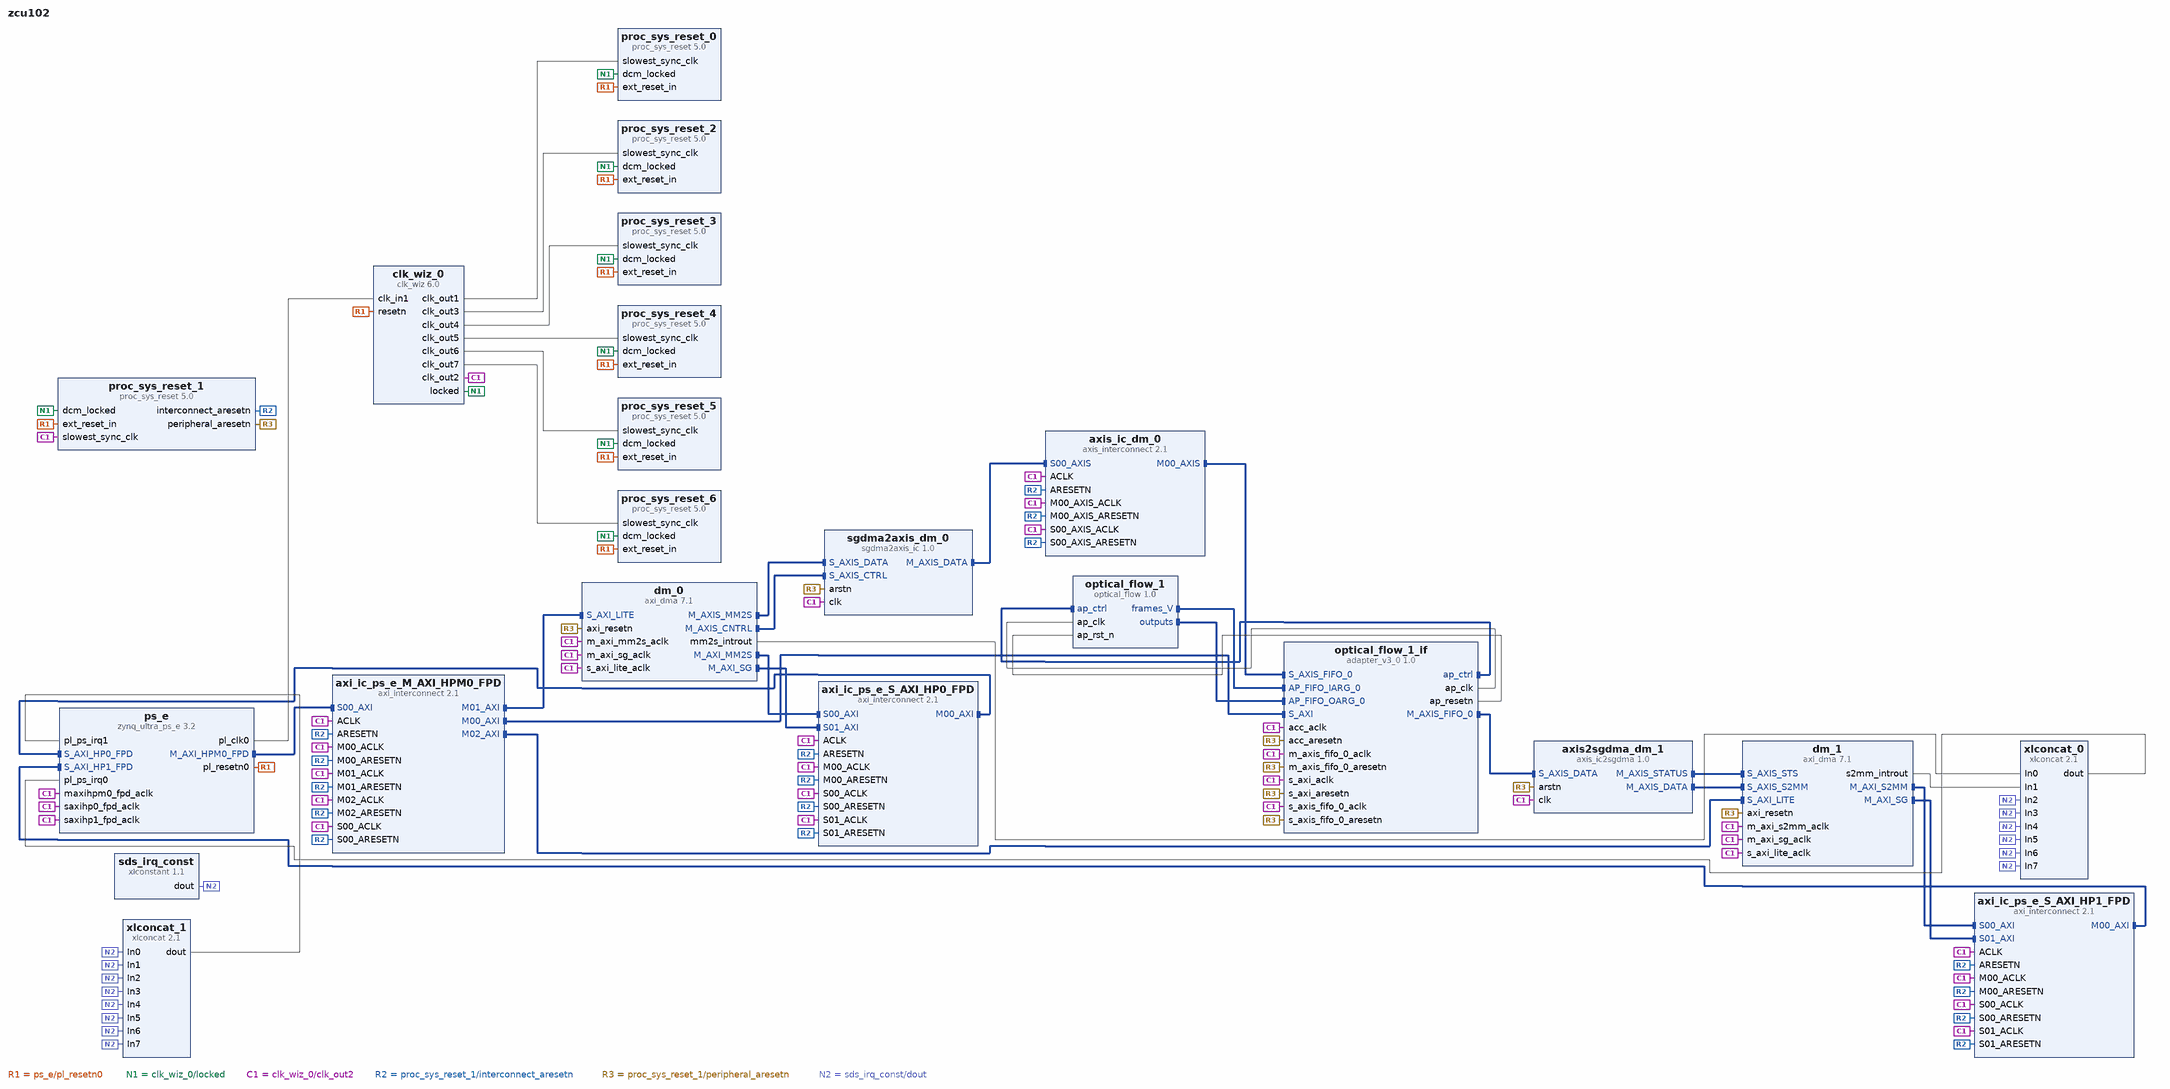
[diagram p0: block diagram of the top level]
# Vivado block design zcu102, xczu9eg-ffvb1156-2-e, Vivado 2018.2
create_bd_design zcu102

create_bd_cell -type ip -vlnv xilinx.com:ip:zynq_ultra_ps_e:3.2 ps_e
set_property -dict [list \
  CONFIG.PSU__PSS_REF_CLK__FREQMHZ 33.330 \
  CONFIG.PSU__CAN1__PERIPHERAL__ENABLE 1 \
  CONFIG.PSU__CAN1__PERIPHERAL__IO {MIO 24 .. 25} \
  CONFIG.PSU__DPAUX__PERIPHERAL__ENABLE 1 \
  CONFIG.PSU__DPAUX__PERIPHERAL__IO {MIO 27 .. 30} \
  CONFIG.PSU__GEM__TSU__ENABLE 0 \
  CONFIG.PSU__FPGA_PL0_ENABLE 1 \
  CONFIG.PSU__ENET3__PERIPHERAL__ENABLE 1 \
  CONFIG.PSU__ENET3__FIFO__ENABLE 0 \
  CONFIG.PSU__ENET3__PTP__ENABLE 0 \
  CONFIG.PSU__ENET3__PERIPHERAL__IO {MIO 64 .. 75} \
  CONFIG.PSU__ENET3__GRP_MDIO__ENABLE 1 \
  CONFIG.PSU__ENET3__GRP_MDIO__IO {MIO 76 .. 77} \
  CONFIG.PSU__GPIO0_MIO__PERIPHERAL__ENABLE 1 \
  CONFIG.PSU__GPIO0_MIO__IO {MIO 0 .. 25} \
  CONFIG.PSU__GPIO1_MIO__PERIPHERAL__ENABLE 1 \
  CONFIG.PSU__GPIO1_MIO__IO {MIO 26 .. 51} \
  CONFIG.PSU__I2C0__PERIPHERAL__ENABLE 1 \
  CONFIG.PSU__I2C0__PERIPHERAL__IO {MIO 14 .. 15} \
  CONFIG.PSU__I2C1__PERIPHERAL__ENABLE 1 \
  CONFIG.PSU__I2C1__PERIPHERAL__IO {MIO 16 .. 17} \
  CONFIG.PSU__PCIE__PERIPHERAL__ENABLE 1 \
  CONFIG.PSU__PCIE__PERIPHERAL__ENDPOINT_ENABLE 0 \
  CONFIG.PSU__PCIE__PERIPHERAL__ROOTPORT_ENABLE 1 \
  CONFIG.PSU__PCIE__PERIPHERAL__ROOTPORT_IO {MIO 31} \
  CONFIG.PSU__PCIE__LANE0__ENABLE 1 \
  CONFIG.PSU__PCIE__LANE0__IO {GT Lane0} \
  CONFIG.PSU__GT__LINK_SPEED HBR \
  CONFIG.PSU__GT__VLT_SWNG_LVL_4 0 \
  CONFIG.PSU__GT__PRE_EMPH_LVL_4 0 \
  CONFIG.PSU__USB0__REF_CLK_SEL {Ref Clk2} \
  CONFIG.PSU__USB0__REF_CLK_FREQ 26 \
  CONFIG.PSU__DP__REF_CLK_SEL {Ref Clk3} \
  CONFIG.PSU__DP__REF_CLK_FREQ 27 \
  CONFIG.PSU__SATA__REF_CLK_SEL {Ref Clk1} \
  CONFIG.PSU__SATA__REF_CLK_FREQ 125 \
  CONFIG.PSU__PCIE__REF_CLK_SEL {Ref Clk0} \
  CONFIG.PSU__PCIE__REF_CLK_FREQ 100 \
  CONFIG.PSU__DP__LANE_SEL {Single Lower} \
  CONFIG.PSU__PCIE__DEVICE_PORT_TYPE {Root Port} \
  CONFIG.PSU__PCIE__MAXIMUM_LINK_WIDTH x1 \
  CONFIG.PSU__PCIE__LINK_SPEED {5.0 Gb/s} \
  CONFIG.PSU__PCIE__BAR0_VAL 0x0 \
  CONFIG.PSU__PCIE__BAR1_VAL 0x0 \
  CONFIG.PSU__PCIE__BAR2_VAL 0x0 \
  CONFIG.PSU__PCIE__BAR3_VAL 0x0 \
  CONFIG.PSU__PCIE__BAR4_VAL 0x0 \
  CONFIG.PSU__PCIE__BAR5_VAL 0x0 \
  CONFIG.PSU__PCIE__EROM_VAL 0x0 \
  CONFIG.PSU__PCIE__MAX_PAYLOAD_SIZE {256 bytes} \
  CONFIG.PSU__PCIE__VENDOR_ID 0x10EE \
  CONFIG.PSU__PCIE__DEVICE_ID 0xD021 \
  CONFIG.PSU__PCIE__REVISION_ID 0x0 \
  CONFIG.PSU__PCIE__SUBSYSTEM_VENDOR_ID 0x10EE \
  CONFIG.PSU__PCIE__SUBSYSTEM_ID 0x7 \
  CONFIG.PSU__PCIE__CLASS_CODE_BASE 0x06 \
  CONFIG.PSU__PCIE__CLASS_CODE_SUB 0x4 \
  CONFIG.PSU__PCIE__CLASS_CODE_INTERFACE 0x0 \
  CONFIG.PSU__PCIE__CLASS_CODE_VALUE 0x60400 \
  CONFIG.PSU__PCIE__CRS_SW_VISIBILITY 1 \
  CONFIG.SUBPRESET1 Custom \
  CONFIG.PSU__PMU__AIBACK__ENABLE 0 \
  CONFIG.PSU__PMU__PLERROR__ENABLE 0 \
  CONFIG.PSU__PMU__PERIPHERAL__ENABLE 1 \
  CONFIG.PSU__PMU__EMIO_GPI__ENABLE 0 \
  CONFIG.PSU__PMU__EMIO_GPO__ENABLE 0 \
  CONFIG.PSU__PMU__GPI0__ENABLE 0 \
  CONFIG.PSU__PMU__GPI1__ENABLE 0 \
  CONFIG.PSU__PMU__GPI2__ENABLE 0 \
  CONFIG.PSU__PMU__GPI3__ENABLE 0 \
  CONFIG.PSU__PMU__GPI4__ENABLE 0 \
  CONFIG.PSU__PMU__GPI5__ENABLE 0 \
  CONFIG.PSU__PMU__GPO0__ENABLE 1 \
  CONFIG.PSU__PMU__GPO1__ENABLE 1 \
  CONFIG.PSU__PMU__GPO2__ENABLE 1 \
  CONFIG.PSU__PMU__GPO3__ENABLE 1 \
  CONFIG.PSU__PMU__GPO4__ENABLE 1 \
  CONFIG.PSU__PMU__GPO5__ENABLE 1 \
  CONFIG.PSU__PMU__GPO0__IO {MIO 32} \
  CONFIG.PSU__PMU__GPO1__IO {MIO 33} \
  CONFIG.PSU__PMU__GPO2__IO {MIO 34} \
  CONFIG.PSU__PMU__GPO3__IO {MIO 35} \
  CONFIG.PSU__PMU__GPO4__IO {MIO 36} \
  CONFIG.PSU__PMU__GPO5__IO {MIO 37} \
  CONFIG.PSU__PMU__GPO2__POLARITY low \
  CONFIG.PSU__PMU__GPO3__POLARITY low \
  CONFIG.PSU__PMU__GPO4__POLARITY low \
  CONFIG.PSU__PMU__GPO5__POLARITY low \
  CONFIG.PSU__QSPI__PERIPHERAL__ENABLE 1 \
  CONFIG.PSU__QSPI__PERIPHERAL__IO {MIO 0 .. 12} \
  CONFIG.PSU__QSPI__PERIPHERAL__MODE {Dual Parallel} \
  CONFIG.PSU__QSPI__PERIPHERAL__DATA_MODE x4 \
  CONFIG.PSU__QSPI__GRP_FBCLK__ENABLE 1 \
  CONFIG.PSU__QSPI__GRP_FBCLK__IO {MIO 6} \
  CONFIG.PSU__SD1__PERIPHERAL__ENABLE 1 \
  CONFIG.PSU__SD1__PERIPHERAL__IO {MIO 39 .. 51} \
  CONFIG.PSU__SD1__GRP_CD__ENABLE 1 \
  CONFIG.PSU__SD1__GRP_CD__IO {MIO 45} \
  CONFIG.PSU__SD1__GRP_POW__ENABLE 0 \
  CONFIG.PSU__SD1__GRP_WP__ENABLE 1 \
  CONFIG.PSU__SD1__GRP_WP__IO {MIO 44} \
  CONFIG.PSU__SD1__SLOT_TYPE {SD 3.0} \
  CONFIG.PSU__SD1__DATA_TRANSFER_MODE 8Bit \
  CONFIG.PSU__SWDT0__PERIPHERAL__ENABLE 1 \
  CONFIG.PSU__SWDT0__CLOCK__ENABLE 0 \
  CONFIG.PSU__SWDT0__RESET__ENABLE 0 \
  CONFIG.PSU__SWDT1__PERIPHERAL__ENABLE 1 \
  CONFIG.PSU__SWDT1__CLOCK__ENABLE 0 \
  CONFIG.PSU__SWDT1__RESET__ENABLE 0 \
  CONFIG.PSU__UART0__BAUD_RATE 115200 \
  CONFIG.PSU__TTC0__PERIPHERAL__ENABLE 1 \
  CONFIG.PSU__TTC0__CLOCK__ENABLE 0 \
  CONFIG.PSU__TTC0__WAVEOUT__ENABLE 0 \
  CONFIG.PSU__TTC1__PERIPHERAL__ENABLE 1 \
  CONFIG.PSU__UART1__BAUD_RATE 115200 \
  CONFIG.PSU__TTC1__CLOCK__ENABLE 0 \
  CONFIG.PSU__TTC1__WAVEOUT__ENABLE 0 \
  CONFIG.PSU__TTC2__PERIPHERAL__ENABLE 1 \
  CONFIG.PSU__TTC2__CLOCK__ENABLE 0 \
  CONFIG.PSU__TTC2__WAVEOUT__ENABLE 0 \
  CONFIG.PSU__TTC3__PERIPHERAL__ENABLE 1 \
  CONFIG.PSU__TTC3__CLOCK__ENABLE 0 \
  CONFIG.PSU__TTC3__WAVEOUT__ENABLE 0 \
  CONFIG.PSU__CSUPMU__PERIPHERAL__VALID 1 \
  CONFIG.PSU__DDRC__BUS_WIDTH {64 Bit} \
  CONFIG.PSU__DDRC__DEVICE_CAPACITY {4096 MBits} \
  CONFIG.PSU__DDRC__DRAM_WIDTH {8 Bits} \
  CONFIG.PSU__DDRC__ECC Disabled \
  CONFIG.PSU__DDRC__MEMORY_TYPE {DDR 4} \
  CONFIG.PSU__DDRC__SPEED_BIN DDR4_2133P \
  CONFIG.PSU__DDRC__COMPONENTS UDIMM \
  CONFIG.PSU__UART0__PERIPHERAL__ENABLE 1 \
  CONFIG.PSU__UART0__PERIPHERAL__IO {MIO 18 .. 19} \
  CONFIG.PSU__UART0__MODEM__ENABLE 0 \
  CONFIG.PSU__UART1__PERIPHERAL__ENABLE 1 \
  CONFIG.PSU__UART1__PERIPHERAL__IO {MIO 20 .. 21} \
  CONFIG.PSU__UART1__MODEM__ENABLE 0 \
  CONFIG.PSU__USB0__PERIPHERAL__ENABLE 1 \
  CONFIG.PSU__USB0__PERIPHERAL__IO {MIO 52 .. 63} \
  CONFIG.PSU__USB3_0__PERIPHERAL__ENABLE 1 \
  CONFIG.PSU__USB3_0__PERIPHERAL__IO {GT Lane2} \
  CONFIG.PSU__USB3_0__EMIO__ENABLE 0 \
  CONFIG.PSU__USB2_0__EMIO__ENABLE 0 \
  CONFIG.PSU__USE__M_AXI_GP0 1 \
  CONFIG.PSU__MAXIGP0__DATA_WIDTH 128 \
  CONFIG.PSU__USE__M_AXI_GP1 0 \
  CONFIG.PSU__USE__M_AXI_GP2 0 \
  CONFIG.PSU__USE__S_AXI_GP2 1 \
  CONFIG.PSU__USE__S_AXI_GP3 1 \
  CONFIG.PSU__USE__IRQ0 1 \
  CONFIG.PSU__USE__IRQ1 1 \
  CONFIG.PSU__PRESET_APPLIED 1 \
  CONFIG.PSU__HIGH_ADDRESS__ENABLE 1 \
  CONFIG.PSU__DDR_HIGH_ADDRESS_GUI_ENABLE 1 \
  CONFIG.PSU_BANK_0_IO_STANDARD LVCMOS18 \
  CONFIG.PSU_BANK_1_IO_STANDARD LVCMOS18 \
  CONFIG.PSU_BANK_2_IO_STANDARD LVCMOS18 \
  CONFIG.PSU__DISPLAYPORT__PERIPHERAL__ENABLE 1 \
  CONFIG.PSU__DISPLAYPORT__LANE0__ENABLE 1 \
  CONFIG.PSU__DISPLAYPORT__LANE0__IO {GT Lane1} \
  CONFIG.PSU__DISPLAYPORT__LANE1__ENABLE 0 \
  CONFIG.PSU__SATA__PERIPHERAL__ENABLE 1 \
  CONFIG.PSU__SATA__LANE1__IO {GT Lane3} \
  CONFIG.PSU__CRL_APB__USB3__ENABLE 1 \
  CONFIG.PSU__CRF_APB__APLL_CTRL__SRCSEL PSS_REF_CLK \
  CONFIG.PSU__CRF_APB__DPLL_CTRL__SRCSEL PSS_REF_CLK \
  CONFIG.PSU__CRF_APB__VPLL_CTRL__SRCSEL PSS_REF_CLK \
  CONFIG.PSU__CRF_APB__ACPU_CTRL__SRCSEL APLL \
  CONFIG.PSU__CRF_APB__DBG_TRACE_CTRL__SRCSEL IOPLL \
  CONFIG.PSU__CRF_APB__DBG_FPD_CTRL__SRCSEL IOPLL \
  CONFIG.PSU__CRF_APB__DP_VIDEO_REF_CTRL__SRCSEL VPLL \
  CONFIG.PSU__CRF_APB__DP_AUDIO_REF_CTRL__SRCSEL RPLL \
  CONFIG.PSU__CRF_APB__DP_STC_REF_CTRL__SRCSEL RPLL \
  CONFIG.PSU__CRF_APB__DDR_CTRL__SRCSEL DPLL \
  CONFIG.PSU__CRF_APB__GPU_REF_CTRL__SRCSEL IOPLL \
  CONFIG.PSU__CRL_APB__PL0_REF_CTRL__SRCSEL IOPLL \
  CONFIG.PSU__CRF_APB__GDMA_REF_CTRL__SRCSEL APLL \
  CONFIG.PSU__CRF_APB__DPDMA_REF_CTRL__SRCSEL APLL \
  CONFIG.PSU__CRF_APB__TOPSW_MAIN_CTRL__SRCSEL DPLL \
  CONFIG.PSU__CRF_APB__TOPSW_LSBUS_CTRL__SRCSEL IOPLL \
  CONFIG.PSU__CRF_APB__DBG_TSTMP_CTRL__SRCSEL IOPLL \
  CONFIG.PSU__CRL_APB__IOPLL_CTRL__SRCSEL PSS_REF_CLK \
  CONFIG.PSU__CRL_APB__RPLL_CTRL__SRCSEL PSS_REF_CLK \
  CONFIG.PSU__CRL_APB__GEM3_REF_CTRL__SRCSEL IOPLL \
  CONFIG.PSU__CRL_APB__USB0_BUS_REF_CTRL__SRCSEL IOPLL \
  CONFIG.PSU__CRL_APB__QSPI_REF_CTRL__SRCSEL IOPLL \
  CONFIG.PSU__CRL_APB__SDIO1_REF_CTRL__SRCSEL IOPLL \
  CONFIG.PSU__CRL_APB__UART0_REF_CTRL__SRCSEL IOPLL \
  CONFIG.PSU__CRL_APB__UART1_REF_CTRL__SRCSEL IOPLL \
  CONFIG.PSU__CRL_APB__I2C0_REF_CTRL__SRCSEL IOPLL \
  CONFIG.PSU__CRL_APB__I2C1_REF_CTRL__SRCSEL IOPLL \
  CONFIG.PSU__CRL_APB__CAN1_REF_CTRL__SRCSEL IOPLL \
  CONFIG.PSU__CRL_APB__CPU_R5_CTRL__SRCSEL IOPLL \
  CONFIG.PSU__CRL_APB__IOU_SWITCH_CTRL__SRCSEL IOPLL \
  CONFIG.PSU__CRL_APB__PCAP_CTRL__SRCSEL IOPLL \
  CONFIG.PSU__CRL_APB__LPD_LSBUS_CTRL__SRCSEL IOPLL \
  CONFIG.PSU__CRL_APB__LPD_SWITCH_CTRL__SRCSEL IOPLL \
  CONFIG.PSU__CRL_APB__DBG_LPD_CTRL__SRCSEL IOPLL \
  CONFIG.PSU__CRL_APB__ADMA_REF_CTRL__SRCSEL IOPLL \
  CONFIG.PSU__CRL_APB__TIMESTAMP_REF_CTRL__SRCSEL IOPLL \
  CONFIG.PSU__CRL_APB__USB3_DUAL_REF_CTRL__SRCSEL IOPLL \
  CONFIG.PSU__IOU_SLCR__IOU_TTC_APB_CLK__TTC0_SEL APB \
  CONFIG.PSU__IOU_SLCR__IOU_TTC_APB_CLK__TTC1_SEL APB \
  CONFIG.PSU__IOU_SLCR__IOU_TTC_APB_CLK__TTC2_SEL APB \
  CONFIG.PSU__IOU_SLCR__IOU_TTC_APB_CLK__TTC3_SEL APB \
  CONFIG.PSU__OVERRIDE__BASIC_CLOCK 0 \
  CONFIG.PSU__DLL__ISUSED 1 \
  CONFIG.PSU__DDR__INTERFACE__FREQMHZ 533.500 \
  CONFIG.PSU__CRF_APB__ACPU_CTRL__FREQMHZ 1200 \
  CONFIG.PSU__CRF_APB__DBG_TRACE_CTRL__FREQMHZ 250 \
  CONFIG.PSU__CRF_APB__DBG_FPD_CTRL__FREQMHZ 250 \
  CONFIG.PSU__CRF_APB__DDR_CTRL__FREQMHZ 1067 \
  CONFIG.PSU__CRF_APB__GPU_REF_CTRL__FREQMHZ 500 \
  CONFIG.PSU__CRL_APB__PL0_REF_CTRL__FREQMHZ 100 \
  CONFIG.PSU__CRF_APB__GDMA_REF_CTRL__FREQMHZ 600 \
  CONFIG.PSU__CRF_APB__DPDMA_REF_CTRL__FREQMHZ 600 \
  CONFIG.PSU__CRF_APB__TOPSW_MAIN_CTRL__FREQMHZ 533.33 \
  CONFIG.PSU__CRF_APB__TOPSW_LSBUS_CTRL__FREQMHZ 100 \
  CONFIG.PSU__CRF_APB__DBG_TSTMP_CTRL__FREQMHZ 250 \
  CONFIG.PSU__CRL_APB__GEM3_REF_CTRL__FREQMHZ 125 \
  CONFIG.PSU__CRL_APB__USB0_BUS_REF_CTRL__FREQMHZ 250 \
  CONFIG.PSU__CRL_APB__QSPI_REF_CTRL__FREQMHZ 125 \
  CONFIG.PSU__CRL_APB__SDIO1_REF_CTRL__FREQMHZ 200 \
  CONFIG.PSU__CRL_APB__UART0_REF_CTRL__FREQMHZ 100 \
  CONFIG.PSU__CRL_APB__UART1_REF_CTRL__FREQMHZ 100 \
  CONFIG.PSU__CRL_APB__I2C0_REF_CTRL__FREQMHZ 100 \
  CONFIG.PSU__CRL_APB__I2C1_REF_CTRL__FREQMHZ 100 \
  CONFIG.PSU__CRL_APB__CAN1_REF_CTRL__FREQMHZ 100 \
  CONFIG.PSU__CRL_APB__CPU_R5_CTRL__FREQMHZ 500 \
  CONFIG.PSU__CRL_APB__IOU_SWITCH_CTRL__FREQMHZ 250 \
  CONFIG.PSU__CRL_APB__PCAP_CTRL__FREQMHZ 200 \
  CONFIG.PSU__CRL_APB__LPD_LSBUS_CTRL__FREQMHZ 100 \
  CONFIG.PSU__CRL_APB__LPD_SWITCH_CTRL__FREQMHZ 500 \
  CONFIG.PSU__CRL_APB__DBG_LPD_CTRL__FREQMHZ 250 \
  CONFIG.PSU__CRL_APB__ADMA_REF_CTRL__FREQMHZ 500 \
  CONFIG.PSU__CRL_APB__TIMESTAMP_REF_CTRL__FREQMHZ 100 \
  CONFIG.PSU__CRL_APB__USB3_DUAL_REF_CTRL__FREQMHZ 20 \
  CONFIG.PSU__PMU_COHERENCY 0 \
  CONFIG.PSU__USB0_COHERENCY 0 \
  CONFIG.PSU__SD1_COHERENCY 0 \
  CONFIG.PSU__QSPI_COHERENCY 0 \
  CONFIG.PSU__ENET3__TSU__ENABLE 0 \
  CONFIG.PSU__GEM3_COHERENCY 0 \
] [get_bd_cells ps_e]
# 100 more settings of ps_e are not shown: defaults, MIO pin electricals, DDR timing, and values the tool derives
create_bd_cell -type ip -vlnv xilinx.com:ip:clk_wiz:6.0 clk_wiz_0
set_property -dict [list \
  CONFIG.CLKOUT2_USED true \
  CONFIG.CLKOUT3_USED true \
  CONFIG.CLKOUT4_USED true \
  CONFIG.CLKOUT5_USED true \
  CONFIG.CLKOUT6_USED true \
  CONFIG.CLKOUT7_USED true \
  CONFIG.NUM_OUT_CLKS 7 \
  CONFIG.CLKOUT1_REQUESTED_OUT_FREQ 75 \
  CONFIG.CLKOUT2_REQUESTED_OUT_FREQ 100 \
  CONFIG.CLKOUT3_REQUESTED_OUT_FREQ 150 \
  CONFIG.CLKOUT4_REQUESTED_OUT_FREQ 200 \
  CONFIG.CLKOUT5_REQUESTED_OUT_FREQ 300 \
  CONFIG.CLKOUT6_REQUESTED_OUT_FREQ 400 \
  CONFIG.CLKOUT7_REQUESTED_OUT_FREQ 600 \
  CONFIG.RESET_PORT resetn \
  CONFIG.MMCM_DIVCLK_DIVIDE 1 \
  CONFIG.MMCM_CLKOUT0_DIVIDE_F 16.000 \
  CONFIG.MMCM_CLKOUT1_DIVIDE 12 \
  CONFIG.MMCM_CLKOUT2_DIVIDE 8 \
  CONFIG.MMCM_CLKOUT3_DIVIDE 6 \
  CONFIG.MMCM_CLKOUT4_DIVIDE 4 \
  CONFIG.MMCM_CLKOUT5_DIVIDE 3 \
  CONFIG.MMCM_CLKOUT6_DIVIDE 2 \
  CONFIG.RESET_TYPE ACTIVE_LOW \
  CONFIG.CLKOUT1_JITTER 122.171 \
  CONFIG.CLKOUT2_JITTER 115.843 \
  CONFIG.CLKOUT2_PHASE_ERROR 87.187 \
  CONFIG.CLKOUT3_JITTER 107.579 \
  CONFIG.CLKOUT3_PHASE_ERROR 87.187 \
  CONFIG.CLKOUT4_JITTER 102.096 \
  CONFIG.CLKOUT4_PHASE_ERROR 87.187 \
  CONFIG.CLKOUT5_JITTER 94.872 \
  CONFIG.CLKOUT5_PHASE_ERROR 87.187 \
  CONFIG.CLKOUT6_JITTER 90.083 \
  CONFIG.CLKOUT6_PHASE_ERROR 87.187 \
  CONFIG.CLKOUT7_JITTER 83.777 \
  CONFIG.CLKOUT7_PHASE_ERROR 87.187 \
] [get_bd_cells clk_wiz_0]
create_bd_cell -type ip -vlnv xilinx.com:ip:proc_sys_reset:5.0 proc_sys_reset_0
create_bd_cell -type ip -vlnv xilinx.com:ip:proc_sys_reset:5.0 proc_sys_reset_1
create_bd_cell -type ip -vlnv xilinx.com:ip:proc_sys_reset:5.0 proc_sys_reset_2
create_bd_cell -type ip -vlnv xilinx.com:ip:proc_sys_reset:5.0 proc_sys_reset_3
create_bd_cell -type ip -vlnv xilinx.com:ip:proc_sys_reset:5.0 proc_sys_reset_4
create_bd_cell -type ip -vlnv xilinx.com:ip:proc_sys_reset:5.0 proc_sys_reset_5
create_bd_cell -type ip -vlnv xilinx.com:ip:proc_sys_reset:5.0 proc_sys_reset_6
create_bd_cell -type ip -vlnv xilinx.com:ip:xlconcat:2.1 xlconcat_0
set_property -dict {CONFIG.NUM_PORTS 8} [get_bd_cells xlconcat_0]
create_bd_cell -type ip -vlnv xilinx.com:ip:xlconcat:2.1 xlconcat_1
set_property -dict {CONFIG.NUM_PORTS 8} [get_bd_cells xlconcat_1]
create_bd_cell -type ip -vlnv xilinx.com:ip:axi_dma:7.1 dm_0
set_property -dict [list \
  CONFIG.c_include_sg 1 \
  CONFIG.c_sg_length_width 26 \
  CONFIG.c_dlytmr_resolution 1250 \
  CONFIG.c_sg_include_stscntrl_strm 1 \
  CONFIG.c_include_mm2s 1 \
  CONFIG.c_m_axi_mm2s_data_width 64 \
  CONFIG.c_m_axis_mm2s_tdata_width 64 \
  CONFIG.c_include_mm2s_dre 1 \
  CONFIG.c_include_mm2s_sf 1 \
  CONFIG.c_mm2s_burst_size 64 \
  CONFIG.c_include_s2mm 0 \
  CONFIG.c_addr_width 36 \
] [get_bd_cells dm_0]
create_bd_cell -type ip -vlnv xilinx.com:ip:axi_dma:7.1 dm_1
set_property -dict [list \
  CONFIG.c_include_sg 1 \
  CONFIG.c_sg_length_width 26 \
  CONFIG.c_dlytmr_resolution 1250 \
  CONFIG.c_sg_include_stscntrl_strm 1 \
  CONFIG.c_include_mm2s 0 \
  CONFIG.c_include_s2mm 1 \
  CONFIG.c_sg_use_stsapp_length 0 \
  CONFIG.c_m_axi_s2mm_data_width 64 \
  CONFIG.c_include_s2mm_dre 1 \
  CONFIG.c_include_s2mm_sf 1 \
  CONFIG.c_s2mm_burst_size 64 \
  CONFIG.c_addr_width 36 \
] [get_bd_cells dm_1]
create_bd_cell -type ip -vlnv xilinx.com:hls:optical_flow:1.0 optical_flow_1
create_bd_cell -type ip -vlnv xilinx.com:ip:adapter_v3_0:1.0 optical_flow_1_if
set_property -dict [list \
  CONFIG.C_NUM_INPUT_FIFOs 1 \
  CONFIG.C_NUM_OUTPUT_FIFOs 1 \
  CONFIG.S_AXIS_FIFO_0_WIDTH 64 \
  CONFIG.S_AXIS_FIFO_0_DEPTH 1024 \
  CONFIG.S_AXIS_FIFO_0_DMWIDTH 64 \
  CONFIG.S_AXIS_FIFO_0_BYTE_WIDTH 64 \
  CONFIG.M_AXIS_FIFO_0_WIDTH 64 \
  CONFIG.M_AXIS_FIFO_0_DEPTH 1024 \
  CONFIG.M_AXIS_FIFO_0_DMWIDTH 64 \
  CONFIG.M_AXIS_FIFO_0_BYTE_WIDTH 64 \
] [get_bd_cells optical_flow_1_if]
create_bd_cell -type ip -vlnv xilinx.com:ip:axi_interconnect:2.1 axi_ic_ps_e_M_AXI_HPM0_FPD
set_property -dict [list \
  CONFIG.NUM_SI 1 \
  CONFIG.NUM_MI 3 \
  CONFIG.STRATEGY 2 \
  CONFIG.M00_HAS_REGSLICE 1 \
  CONFIG.M01_HAS_REGSLICE 1 \
  CONFIG.M02_HAS_REGSLICE 1 \
  CONFIG.S00_HAS_REGSLICE 1 \
] [get_bd_cells axi_ic_ps_e_M_AXI_HPM0_FPD]
create_bd_cell -type ip -vlnv xilinx.com:ip:axi_interconnect:2.1 axi_ic_ps_e_S_AXI_HP0_FPD
set_property -dict [list \
  CONFIG.NUM_SI 2 \
  CONFIG.NUM_MI 1 \
  CONFIG.STRATEGY 2 \
  CONFIG.M00_HAS_REGSLICE 1 \
  CONFIG.M00_HAS_DATA_FIFO 2 \
  CONFIG.S00_HAS_REGSLICE 1 \
  CONFIG.S01_HAS_REGSLICE 1 \
  CONFIG.S00_HAS_DATA_FIFO 2 \
  CONFIG.S01_HAS_DATA_FIFO 2 \
] [get_bd_cells axi_ic_ps_e_S_AXI_HP0_FPD]
create_bd_cell -type ip -vlnv xilinx.com:ip:axi_interconnect:2.1 axi_ic_ps_e_S_AXI_HP1_FPD
set_property -dict [list \
  CONFIG.NUM_SI 2 \
  CONFIG.NUM_MI 1 \
  CONFIG.STRATEGY 2 \
  CONFIG.M00_HAS_REGSLICE 1 \
  CONFIG.M00_HAS_DATA_FIFO 2 \
  CONFIG.S00_HAS_REGSLICE 1 \
  CONFIG.S01_HAS_REGSLICE 1 \
  CONFIG.S00_HAS_DATA_FIFO 2 \
  CONFIG.S01_HAS_DATA_FIFO 2 \
] [get_bd_cells axi_ic_ps_e_S_AXI_HP1_FPD]
create_bd_cell -type ip -vlnv xilinx.com:ip:sgdma2axis_ic:1.0 sgdma2axis_dm_0
create_bd_cell -type ip -vlnv xilinx.com:ip:axis_interconnect:2.1 axis_ic_dm_0
set_property -dict [list \
  CONFIG.NUM_SI 1 \
  CONFIG.NUM_MI 1 \
  CONFIG.M00_HAS_REGSLICE 1 \
  CONFIG.S00_HAS_REGSLICE 1 \
] [get_bd_cells axis_ic_dm_0]
create_bd_cell -type ip -vlnv xilinx.com:ip:axis_ic2sgdma:1.0 axis2sgdma_dm_1
create_bd_cell -type ip -vlnv xilinx.com:ip:xlconstant:1.1 sds_irq_const
set_property -dict {CONFIG.CONST_WIDTH 1 CONFIG.CONST_VAL 0} [get_bd_cells sds_irq_const]

# ---- connections ----

connect_bd_intf_net [get_bd_intf_pins optical_flow_1/frames_V] [get_bd_intf_pins optical_flow_1_if/AP_FIFO_IARG_0]
connect_bd_intf_net [get_bd_intf_pins optical_flow_1/outputs] [get_bd_intf_pins optical_flow_1_if/AP_FIFO_OARG_0]
connect_bd_intf_net [get_bd_intf_pins optical_flow_1_if/ap_ctrl] [get_bd_intf_pins optical_flow_1/ap_ctrl]
connect_bd_intf_net [get_bd_intf_pins ps_e/M_AXI_HPM0_FPD] [get_bd_intf_pins axi_ic_ps_e_M_AXI_HPM0_FPD/S00_AXI]
connect_bd_intf_net [get_bd_intf_pins axi_ic_ps_e_S_AXI_HP0_FPD/M00_AXI] [get_bd_intf_pins ps_e/S_AXI_HP0_FPD]
connect_bd_intf_net [get_bd_intf_pins axi_ic_ps_e_S_AXI_HP1_FPD/M00_AXI] [get_bd_intf_pins ps_e/S_AXI_HP1_FPD]
connect_bd_intf_net [get_bd_intf_pins sgdma2axis_dm_0/M_AXIS_DATA] [get_bd_intf_pins axis_ic_dm_0/S00_AXIS]
connect_bd_intf_net [get_bd_intf_pins axi_ic_ps_e_M_AXI_HPM0_FPD/M00_AXI] [get_bd_intf_pins optical_flow_1_if/S_AXI]
connect_bd_intf_net [get_bd_intf_pins axi_ic_ps_e_M_AXI_HPM0_FPD/M01_AXI] [get_bd_intf_pins dm_0/S_AXI_LITE]
connect_bd_intf_net [get_bd_intf_pins dm_0/M_AXI_MM2S] [get_bd_intf_pins axi_ic_ps_e_S_AXI_HP0_FPD/S00_AXI]
connect_bd_intf_net [get_bd_intf_pins dm_0/M_AXI_SG] [get_bd_intf_pins axi_ic_ps_e_S_AXI_HP0_FPD/S01_AXI]
connect_bd_intf_net [get_bd_intf_pins dm_0/M_AXIS_MM2S] [get_bd_intf_pins sgdma2axis_dm_0/S_AXIS_DATA]
connect_bd_intf_net [get_bd_intf_pins dm_0/M_AXIS_CNTRL] [get_bd_intf_pins sgdma2axis_dm_0/S_AXIS_CTRL]
connect_bd_intf_net [get_bd_intf_pins axis_ic_dm_0/M00_AXIS] [get_bd_intf_pins optical_flow_1_if/S_AXIS_FIFO_0]
connect_bd_intf_net [get_bd_intf_pins axi_ic_ps_e_M_AXI_HPM0_FPD/M02_AXI] [get_bd_intf_pins dm_1/S_AXI_LITE]
connect_bd_intf_net [get_bd_intf_pins dm_1/M_AXI_S2MM] [get_bd_intf_pins axi_ic_ps_e_S_AXI_HP1_FPD/S00_AXI]
connect_bd_intf_net [get_bd_intf_pins dm_1/M_AXI_SG] [get_bd_intf_pins axi_ic_ps_e_S_AXI_HP1_FPD/S01_AXI]
connect_bd_intf_net [get_bd_intf_pins axis2sgdma_dm_1/M_AXIS_STATUS] [get_bd_intf_pins dm_1/S_AXIS_STS]
connect_bd_intf_net [get_bd_intf_pins axis2sgdma_dm_1/M_AXIS_DATA] [get_bd_intf_pins dm_1/S_AXIS_S2MM]
connect_bd_intf_net [get_bd_intf_pins optical_flow_1_if/M_AXIS_FIFO_0] [get_bd_intf_pins axis2sgdma_dm_1/S_AXIS_DATA]
connect_bd_net [get_bd_pins ps_e/pl_resetn0] \
  [get_bd_pins clk_wiz_0/resetn] [get_bd_pins proc_sys_reset_0/ext_reset_in] [get_bd_pins proc_sys_reset_1/ext_reset_in] \
  [get_bd_pins proc_sys_reset_2/ext_reset_in] [get_bd_pins proc_sys_reset_3/ext_reset_in] \
  [get_bd_pins proc_sys_reset_4/ext_reset_in] [get_bd_pins proc_sys_reset_5/ext_reset_in] \
  [get_bd_pins proc_sys_reset_6/ext_reset_in]
connect_bd_net [get_bd_pins clk_wiz_0/locked] \
  [get_bd_pins proc_sys_reset_0/dcm_locked] [get_bd_pins proc_sys_reset_1/dcm_locked] \
  [get_bd_pins proc_sys_reset_2/dcm_locked] [get_bd_pins proc_sys_reset_3/dcm_locked] \
  [get_bd_pins proc_sys_reset_4/dcm_locked] [get_bd_pins proc_sys_reset_5/dcm_locked] \
  [get_bd_pins proc_sys_reset_6/dcm_locked]
connect_bd_net [get_bd_pins clk_wiz_0/clk_out1] [get_bd_pins proc_sys_reset_0/slowest_sync_clk]
connect_bd_net [get_bd_pins clk_wiz_0/clk_out2] \
  [get_bd_pins proc_sys_reset_1/slowest_sync_clk] [get_bd_pins ps_e/maxihpm0_fpd_aclk] [get_bd_pins ps_e/saxihp0_fpd_aclk] \
  [get_bd_pins ps_e/saxihp1_fpd_aclk] [get_bd_pins dm_0/s_axi_lite_aclk] [get_bd_pins dm_0/m_axi_sg_aclk] \
  [get_bd_pins dm_0/m_axi_mm2s_aclk] [get_bd_pins dm_1/s_axi_lite_aclk] [get_bd_pins dm_1/m_axi_sg_aclk] \
  [get_bd_pins dm_1/m_axi_s2mm_aclk] [get_bd_pins optical_flow_1_if/s_axi_aclk] \
  [get_bd_pins optical_flow_1_if/s_axis_fifo_0_aclk] [get_bd_pins optical_flow_1_if/m_axis_fifo_0_aclk] \
  [get_bd_pins optical_flow_1_if/acc_aclk] [get_bd_pins axi_ic_ps_e_M_AXI_HPM0_FPD/S00_ACLK] \
  [get_bd_pins axi_ic_ps_e_M_AXI_HPM0_FPD/M00_ACLK] [get_bd_pins axi_ic_ps_e_M_AXI_HPM0_FPD/M01_ACLK] \
  [get_bd_pins axi_ic_ps_e_M_AXI_HPM0_FPD/M02_ACLK] [get_bd_pins axi_ic_ps_e_M_AXI_HPM0_FPD/ACLK] \
  [get_bd_pins axi_ic_ps_e_S_AXI_HP0_FPD/S00_ACLK] [get_bd_pins axi_ic_ps_e_S_AXI_HP0_FPD/S01_ACLK] \
  [get_bd_pins axi_ic_ps_e_S_AXI_HP1_FPD/S00_ACLK] [get_bd_pins axi_ic_ps_e_S_AXI_HP1_FPD/S01_ACLK] \
  [get_bd_pins sgdma2axis_dm_0/clk] [get_bd_pins axis_ic_dm_0/ACLK] [get_bd_pins axis_ic_dm_0/S00_AXIS_ACLK] \
  [get_bd_pins axis_ic_dm_0/M00_AXIS_ACLK] [get_bd_pins axis2sgdma_dm_1/clk] [get_bd_pins axi_ic_ps_e_S_AXI_HP0_FPD/ACLK] \
  [get_bd_pins axi_ic_ps_e_S_AXI_HP0_FPD/M00_ACLK] [get_bd_pins axi_ic_ps_e_S_AXI_HP1_FPD/ACLK] \
  [get_bd_pins axi_ic_ps_e_S_AXI_HP1_FPD/M00_ACLK]
connect_bd_net [get_bd_pins clk_wiz_0/clk_out3] [get_bd_pins proc_sys_reset_2/slowest_sync_clk]
connect_bd_net [get_bd_pins clk_wiz_0/clk_out4] [get_bd_pins proc_sys_reset_3/slowest_sync_clk]
connect_bd_net [get_bd_pins clk_wiz_0/clk_out5] [get_bd_pins proc_sys_reset_4/slowest_sync_clk]
connect_bd_net [get_bd_pins clk_wiz_0/clk_out6] [get_bd_pins proc_sys_reset_5/slowest_sync_clk]
connect_bd_net [get_bd_pins clk_wiz_0/clk_out7] [get_bd_pins proc_sys_reset_6/slowest_sync_clk]
connect_bd_net [get_bd_pins ps_e/pl_clk0] [get_bd_pins clk_wiz_0/clk_in1]
connect_bd_net [get_bd_pins xlconcat_0/dout] [get_bd_pins ps_e/pl_ps_irq0]
connect_bd_net [get_bd_pins xlconcat_1/dout] [get_bd_pins ps_e/pl_ps_irq1]
connect_bd_net [get_bd_pins optical_flow_1_if/ap_clk] [get_bd_pins optical_flow_1/ap_clk]
connect_bd_net [get_bd_pins optical_flow_1_if/ap_resetn] [get_bd_pins optical_flow_1/ap_rst_n]
connect_bd_net [get_bd_pins proc_sys_reset_1/interconnect_aresetn] \
  [get_bd_pins axi_ic_ps_e_M_AXI_HPM0_FPD/S00_ARESETN] [get_bd_pins axi_ic_ps_e_M_AXI_HPM0_FPD/M00_ARESETN] \
  [get_bd_pins axi_ic_ps_e_M_AXI_HPM0_FPD/M01_ARESETN] [get_bd_pins axi_ic_ps_e_M_AXI_HPM0_FPD/M02_ARESETN] \
  [get_bd_pins axi_ic_ps_e_M_AXI_HPM0_FPD/ARESETN] [get_bd_pins axi_ic_ps_e_S_AXI_HP0_FPD/M00_ARESETN] \
  [get_bd_pins axi_ic_ps_e_S_AXI_HP0_FPD/S00_ARESETN] [get_bd_pins axi_ic_ps_e_S_AXI_HP0_FPD/S01_ARESETN] \
  [get_bd_pins axi_ic_ps_e_S_AXI_HP1_FPD/M00_ARESETN] [get_bd_pins axi_ic_ps_e_S_AXI_HP1_FPD/S00_ARESETN] \
  [get_bd_pins axi_ic_ps_e_S_AXI_HP1_FPD/S01_ARESETN] [get_bd_pins axis_ic_dm_0/ARESETN] \
  [get_bd_pins axis_ic_dm_0/S00_AXIS_ARESETN] [get_bd_pins axis_ic_dm_0/M00_AXIS_ARESETN] \
  [get_bd_pins axi_ic_ps_e_S_AXI_HP0_FPD/ARESETN] [get_bd_pins axi_ic_ps_e_S_AXI_HP1_FPD/ARESETN]
connect_bd_net [get_bd_pins proc_sys_reset_1/peripheral_aresetn] \
  [get_bd_pins dm_0/axi_resetn] [get_bd_pins dm_1/axi_resetn] [get_bd_pins optical_flow_1_if/s_axi_aresetn] \
  [get_bd_pins optical_flow_1_if/s_axis_fifo_0_aresetn] [get_bd_pins optical_flow_1_if/m_axis_fifo_0_aresetn] \
  [get_bd_pins optical_flow_1_if/acc_aresetn] [get_bd_pins sgdma2axis_dm_0/arstn] [get_bd_pins axis2sgdma_dm_1/arstn]
connect_bd_net [get_bd_pins dm_0/mm2s_introut] [get_bd_pins xlconcat_0/In0]
connect_bd_net [get_bd_pins dm_1/s2mm_introut] [get_bd_pins xlconcat_0/In1]
connect_bd_net [get_bd_pins sds_irq_const/dout] \
  [get_bd_pins xlconcat_0/In2] [get_bd_pins xlconcat_0/In3] [get_bd_pins xlconcat_0/In4] [get_bd_pins xlconcat_0/In5] \
  [get_bd_pins xlconcat_0/In6] [get_bd_pins xlconcat_0/In7] [get_bd_pins xlconcat_1/In0] [get_bd_pins xlconcat_1/In1] \
  [get_bd_pins xlconcat_1/In2] [get_bd_pins xlconcat_1/In3] [get_bd_pins xlconcat_1/In4] [get_bd_pins xlconcat_1/In5] \
  [get_bd_pins xlconcat_1/In6] [get_bd_pins xlconcat_1/In7]

# ---- address map ----
assign_bd_address -offset 0x000000000 -range 2G -target_address_space [get_bd_addr_spaces dm_0/Data_MM2S] [get_bd_addr_segs ps_e/SAXIGP2/HP0_DDR_LOW]
assign_bd_address -offset 0x0C0000000 -range 512M -target_address_space [get_bd_addr_spaces dm_0/Data_MM2S] [get_bd_addr_segs ps_e/SAXIGP2/HP0_QSPI]
assign_bd_address -offset 0x0E0000000 -range 256M -target_address_space [get_bd_addr_spaces dm_0/Data_MM2S] [get_bd_addr_segs ps_e/SAXIGP2/HP0_PCIE_LOW]
assign_bd_address -offset 0x600000000 -range 8G -target_address_space [get_bd_addr_spaces dm_0/Data_MM2S] [get_bd_addr_segs ps_e/SAXIGP2/HP0_PCIE_HIGH1]
assign_bd_address -offset 0x800000000 -range 32G -target_address_space [get_bd_addr_spaces dm_0/Data_MM2S] [get_bd_addr_segs ps_e/SAXIGP2/HP0_DDR_HIGH]
exclude_bd_addr_seg -offset 0x0FF000000 -range 16M -target_address_space [get_bd_addr_spaces dm_0/Data_MM2S] [get_bd_addr_segs ps_e/SAXIGP2/HP0_LPS_OCM]
assign_bd_address -offset 0x000000000 -range 2G -target_address_space [get_bd_addr_spaces dm_0/Data_SG] [get_bd_addr_segs ps_e/SAXIGP2/HP0_DDR_LOW]
assign_bd_address -offset 0x0C0000000 -range 512M -target_address_space [get_bd_addr_spaces dm_0/Data_SG] [get_bd_addr_segs ps_e/SAXIGP2/HP0_QSPI]
assign_bd_address -offset 0x0E0000000 -range 256M -target_address_space [get_bd_addr_spaces dm_0/Data_SG] [get_bd_addr_segs ps_e/SAXIGP2/HP0_PCIE_LOW]
assign_bd_address -offset 0x600000000 -range 8G -target_address_space [get_bd_addr_spaces dm_0/Data_SG] [get_bd_addr_segs ps_e/SAXIGP2/HP0_PCIE_HIGH1]
assign_bd_address -offset 0x800000000 -range 32G -target_address_space [get_bd_addr_spaces dm_0/Data_SG] [get_bd_addr_segs ps_e/SAXIGP2/HP0_DDR_HIGH]
exclude_bd_addr_seg -offset 0x0FF000000 -range 16M -target_address_space [get_bd_addr_spaces dm_0/Data_SG] [get_bd_addr_segs ps_e/SAXIGP2/HP0_LPS_OCM]
assign_bd_address -offset 0x000000000 -range 2G -target_address_space [get_bd_addr_spaces dm_1/Data_S2MM] [get_bd_addr_segs ps_e/SAXIGP3/HP1_DDR_LOW]
assign_bd_address -offset 0x0C0000000 -range 512M -target_address_space [get_bd_addr_spaces dm_1/Data_S2MM] [get_bd_addr_segs ps_e/SAXIGP3/HP1_QSPI]
assign_bd_address -offset 0x0E0000000 -range 256M -target_address_space [get_bd_addr_spaces dm_1/Data_S2MM] [get_bd_addr_segs ps_e/SAXIGP3/HP1_PCIE_LOW]
assign_bd_address -offset 0x600000000 -range 8G -target_address_space [get_bd_addr_spaces dm_1/Data_S2MM] [get_bd_addr_segs ps_e/SAXIGP3/HP1_PCIE_HIGH1]
assign_bd_address -offset 0x800000000 -range 32G -target_address_space [get_bd_addr_spaces dm_1/Data_S2MM] [get_bd_addr_segs ps_e/SAXIGP3/HP1_DDR_HIGH]
exclude_bd_addr_seg -offset 0x0FF000000 -range 16M -target_address_space [get_bd_addr_spaces dm_1/Data_S2MM] [get_bd_addr_segs ps_e/SAXIGP3/HP1_LPS_OCM]
assign_bd_address -offset 0x000000000 -range 2G -target_address_space [get_bd_addr_spaces dm_1/Data_SG] [get_bd_addr_segs ps_e/SAXIGP3/HP1_DDR_LOW]
assign_bd_address -offset 0x0C0000000 -range 512M -target_address_space [get_bd_addr_spaces dm_1/Data_SG] [get_bd_addr_segs ps_e/SAXIGP3/HP1_QSPI]
assign_bd_address -offset 0x0E0000000 -range 256M -target_address_space [get_bd_addr_spaces dm_1/Data_SG] [get_bd_addr_segs ps_e/SAXIGP3/HP1_PCIE_LOW]
assign_bd_address -offset 0x600000000 -range 8G -target_address_space [get_bd_addr_spaces dm_1/Data_SG] [get_bd_addr_segs ps_e/SAXIGP3/HP1_PCIE_HIGH1]
assign_bd_address -offset 0x800000000 -range 32G -target_address_space [get_bd_addr_spaces dm_1/Data_SG] [get_bd_addr_segs ps_e/SAXIGP3/HP1_DDR_HIGH]
exclude_bd_addr_seg -offset 0x0FF000000 -range 16M -target_address_space [get_bd_addr_spaces dm_1/Data_SG] [get_bd_addr_segs ps_e/SAXIGP3/HP1_LPS_OCM]
assign_bd_address -offset 0x000A0000000 -range 4K -target_address_space [get_bd_addr_spaces ps_e/Data] [get_bd_addr_segs dm_0/S_AXI_LITE/Reg]
assign_bd_address -offset 0x000A0001000 -range 4K -target_address_space [get_bd_addr_spaces ps_e/Data] [get_bd_addr_segs dm_1/S_AXI_LITE/Reg]
assign_bd_address -offset 0x000A0010000 -range 64K -target_address_space [get_bd_addr_spaces ps_e/Data] [get_bd_addr_segs optical_flow_1_if/S_AXI/reg0]

validate_bd_design
save_bd_design
